# Altium schematic sheet schematic MUX_DEMUX.SchDoc
size A4
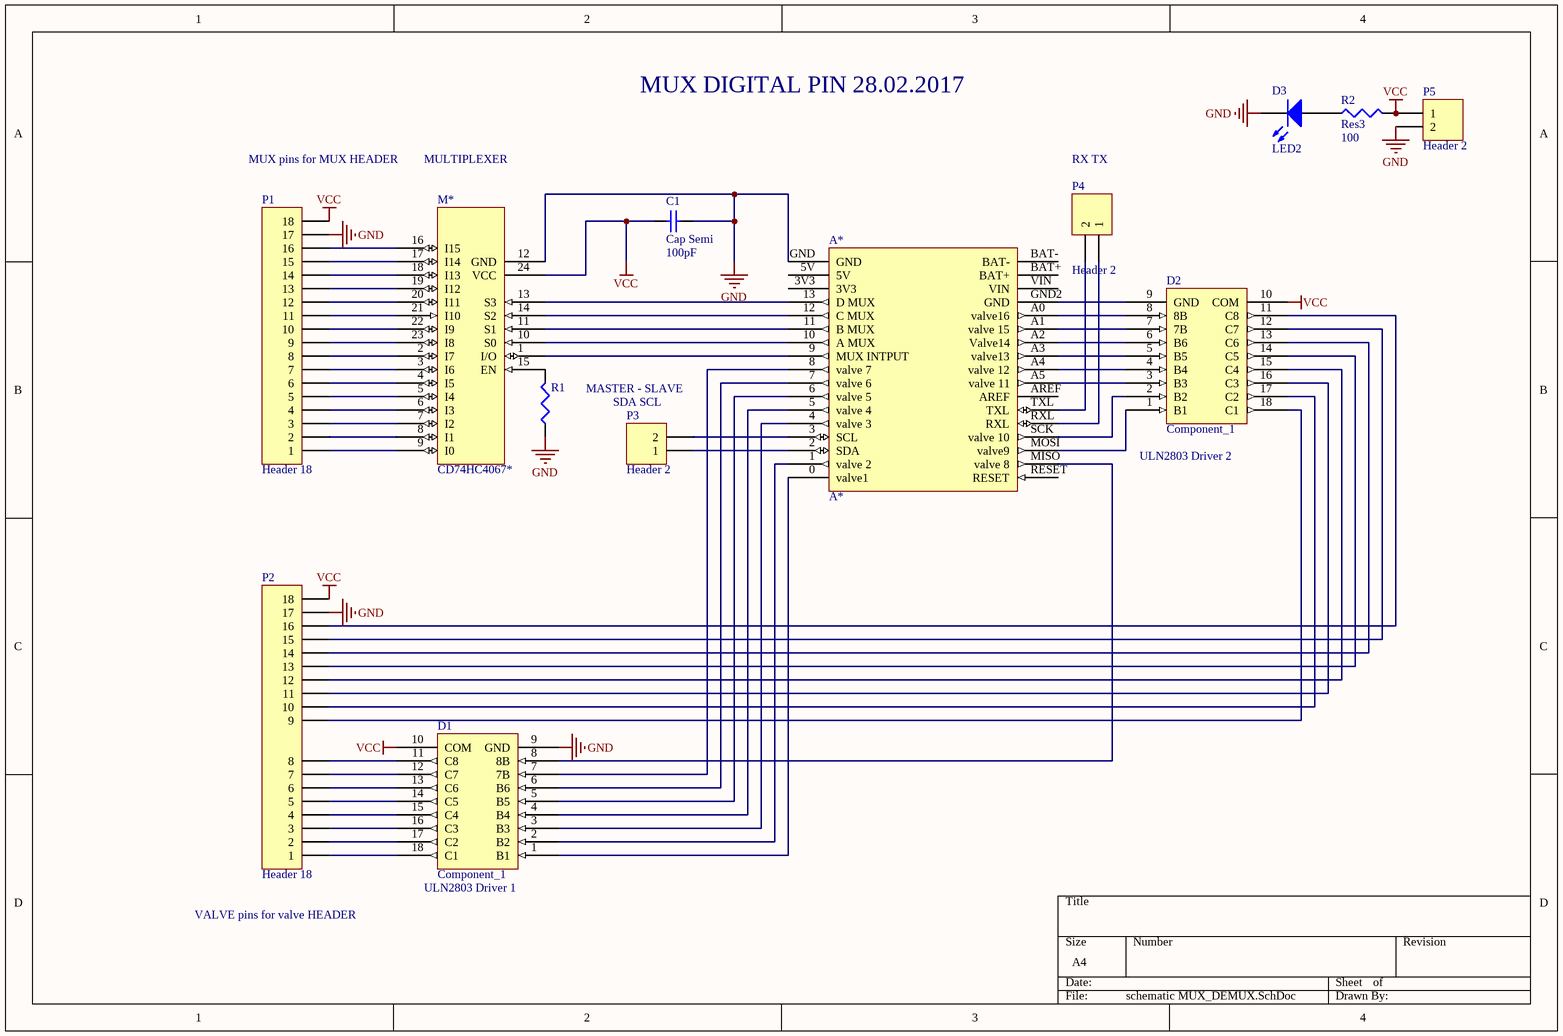
[diagram p0: schematic MUX_DEMUX.SchDoc]

## Parts
A*  A*  [PCBComponent_1 - duplicate]
C1  Cap Semi  value 100pF  [C1206]
D1  Component_1  [SOIC127P1030X265-18N]
D2  Component_1  [SOIC127P1030X265-18N]
D3  LED2  [3.2X1.6X1.1]
M*  CD74HC4067*  [SOP65P780X200-24N]
P1  Header 18  [HDR1X18]
P2  Header 18  [HDR1X20]
P3  Header 2  [HDR1X2]
P4  Header 2  [HDR1X2]
P5  Header 2  [HDR1X2]
R1  10K  [J1-0603]  (value not drawn)
R2  Res3  value 100  [J1-0603]

## Nets
GND: A*.GND C1.2 D1.9(GND) D3.2(K) M*.12(GND) P1.17 P2.19(17) P5.2 R1.1
VCC: C1.1 D1.10(COM) D2.10(COM) M*.24(VCC) P1.18 P2.20(18) P5.1 R2.2
NetA*_0: A*.0(valve1) D1.1(B1)
NetA*_1: A*.1(valve_2) D1.2(B2)
NetA*_2: A*.2(SDA) P3.1
NetA*_3: A*.3(SCL) P3.2
NetA*_4: A*.4(valve_3) D1.3(B3)
NetA*_5: A*.5(valve_4) D1.4(B4)
NetA*_6: A*.6(valve_5) D1.5(B5)
NetA*_7: A*.7(valve_6) D1.6(B6)
NetA*_8: A*.8(valve_7) D1.7(7B)
NetA*_9: A*.9(MUX_INTPUT) M*.1(I/O)
NetA*_10: A*.10(A_MUX) M*.10(S0)
NetA*_11: A*.11(B_MUX) M*.11(S1)
NetA*_12: A*.12(C_MUX) M*.14(S2)
NetA*_13: A*.13(D_MUX) M*.13(S3)
NetA*_A0: A*.A0(valve16) D2.8(8B)
NetA*_A1: A*.A1(valve_15) D2.7(7B)
NetA*_A2: A*.A2(Valve14) D2.6(B6)
NetA*_A3: A*.A3(valve13) D2.5(B5)
NetA*_A4: A*.A4(valve_12) D2.4(B4)
NetA*_A5: A*.A5(valve_11) D2.3(B3)
NetA*_GND2: A*.GND2(GND) D2.9(GND)
NetA*_MISO: A*.MISO(valve_8) D1.8(8B)
NetA*_MOSI: A*.MOSI(valve9) D2.1(B1)
NetA*_RXL: A*.RXL P4.1
NetA*_SCK: A*.SCK(valve_10) D2.2(B2)
NetA*_TXL: A*.TXL P4.2
NetD1_11: D1.11(C8) P2.8
NetD1_12: D1.12(C7) P2.7
NetD1_13: D1.13(C6) P2.6
NetD1_14: D1.14(C5) P2.5
NetD1_15: D1.15(C4) P2.4
NetD1_16: D1.16(C3) P2.3
NetD1_17: D1.17(C2) P2.2
NetD1_18: D1.18(C1) P2.1
NetD2_11: D2.11(C8) P2.18(16)
NetD2_12: D2.12(C7) P2.17(15)
NetD2_13: D2.13(C6) P2.16(14)
NetD2_14: D2.14(C5) P2.15(13)
NetD2_15: D2.15(C4) P2.14(12)
NetD2_16: D2.16(C3) P2.13(11)
NetD2_17: D2.17(C2) P2.12(10)
NetD2_18: D2.18(C1) P2.11(9)
NetD3_1: D3.1(A) R2.1
NetM*_2: M*.2(I7) P1.8
NetM*_3: M*.3(I6) P1.7
NetM*_4: M*.4(I5) P1.6
NetM*_5: M*.5(I4) P1.5
NetM*_6: M*.6(I3) P1.4
NetM*_7: M*.7(I2) P1.3
NetM*_8: M*.8(I1) P1.2
NetM*_9: M*.9(I0) P1.1
NetM*_15: M*.15(EN) R1.2
NetM*_16: M*.16(I15) P1.16
NetM*_17: M*.17(I14) P1.15
NetM*_18: M*.18(I13) P1.14
NetM*_19: M*.19(I12) P1.13
NetM*_20: M*.20(I11) P1.12
NetM*_21: M*.21(I10) P1.11
NetM*_22: M*.22(I9) P1.10
NetM*_23: M*.23(I8) P1.9

Not connected (* = marked no-connect by the designer): A* 3V3 5V AREF BAT+ BAT- RESET VIN

## Notes on the sheet
- MUX DIGITAL PIN 28.02.2017
- MUX pins for MUX HEADER
- MULTIPLEXER
- RX TX
- MASTER - SLAVE
- (near P3) SDA SCL
- (near D2) ULN2803 Driver 2
- VALVE pins for valve HEADER
- (near D1) ULN2803 Driver 1

## Library data of the parts
A* = ARDUINO POLOLU
C1 = Cap Semi: Capacitor (Semiconductor SIM Model); Published: 8-Jun-2000; LatestRevisionDate: 29-May-2009; LatestRevisionNote: IPC-7351 Footprint Added.; PackageReference: C1206; Publisher: Altium Limited; PackageDescription: Chip Capacitor
D3 = LED2: Typical RED, GREEN, YELLOW, AMBER GaAs LED; Published: 8-Jun-2000; LatestRevisionDate: 17-Jul-2002; LatestRevisionNote: Re-released for DXP Platform.; PackageVersion: Feb-2002; PackageReference: 3.2X1.6X1.1; Publisher: Altium Limited; PackageDescription: SM LED; 2 Flat Leads
M* = Component_1: analog mux/demux
P1 = Header 18: Header, 18-Pin; LatestRevisionDate: 17-Jul-2002; LatestRevisionNote: Re-released for DXP Platform.; Publisher: Altium Limited
P2 = Header 20: Header, 20-Pin; LatestRevisionDate: 17-Jul-2002; LatestRevisionNote: Re-released for DXP Platform.; Publisher: Altium Limited
P3-P5 = Header 2: Header, 2-Pin; LatestRevisionDate: 17-Jul-2002; LatestRevisionNote: Re-released for DXP Platform.; Publisher: Altium Limited
R1 R2 = Res3: Resistor; Published: 8-Jun-2000; LatestRevisionDate: 29-May-2009; LatestRevisionNote: IPC-7351 Footprint Added.; PackageReference: J1-0603; Publisher: Altium Limited; PackageDescription: Chip Resistor